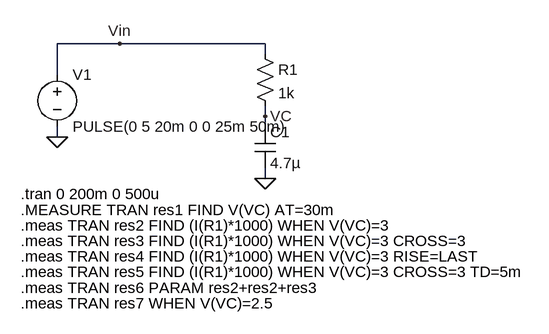
[diagram p0: schematic Measure Diretiva Spice 001.asc]
Measure Diretiva Spice 001.asc, the LTspice schematic file:
Version 4
SHEET 1 880 680
WIRE 80 0 -16 0
WIRE 304 0 80 0
WIRE 304 16 304 0
WIRE -16 48 -16 0
WIRE 304 112 304 96
WIRE 304 128 304 112
WIRE -16 144 -16 128
WIRE 304 208 304 192
FLAG -16 144 0
FLAG 304 208 0
FLAG 304 112 VC
FLAG 80 0 Vin
SYMBOL voltage -16 32 R0
WINDOW 123 0 0 Left 0
WINDOW 39 0 0 Left 0
SYMATTR InstName V1
SYMATTR Value PULSE(0 5 20m 0 0 25m 50m)
SYMBOL cap 288 128 R0
SYMATTR InstName C1
SYMATTR Value 4.7µ
SYMBOL res 288 0 R0
SYMATTR InstName R1
SYMATTR Value 1k
TEXT -72 256 Left 2 !.MEASURE TRAN res1 FIND V(VC) AT=30m
TEXT -72 232 Left 2 !.tran 0 200m 0 500u
TEXT -72 280 Left 2 !.meas TRAN res2 FIND (I(R1)*1000) WHEN V(VC)=3
TEXT -72 304 Left 2 !.meas TRAN res3 FIND (I(R1)*1000) WHEN V(VC)=3 CROSS=3
TEXT -72 328 Left 2 !.meas TRAN res4 FIND (I(R1)*1000) WHEN V(VC)=3 RISE=LAST
TEXT -72 352 Left 2 !.meas TRAN res5 FIND (I(R1)*1000) WHEN V(VC)=3 CROSS=3 TD=5m
TEXT -72 376 Left 2 !.meas TRAN res6 PARAM res2+res2+res3
TEXT -72 400 Left 2 !.meas TRAN res7 WHEN V(VC)=2.5

The netlist it stands for:
* Measure Diretiva Spice 001.asc
V1 Vin 0 PULSE(0 5 20m 0 0 25m 50m)
C1 VC 0 4.7µ
R1 Vin VC 1k
.MEASURE TRAN res1 FIND V(VC) AT=30m
.tran 0 200m 0 500u
.meas TRAN res2 FIND (I(R1)*1000) WHEN V(VC)=3
.meas TRAN res3 FIND (I(R1)*1000) WHEN V(VC)=3 CROSS=3
.meas TRAN res4 FIND (I(R1)*1000) WHEN V(VC)=3 RISE=LAST
.meas TRAN res5 FIND (I(R1)*1000) WHEN V(VC)=3 CROSS=3 TD=5m
.meas TRAN res6 PARAM res2+res2+res3
.meas TRAN res7 WHEN V(VC)=2.5
.backanno
.end